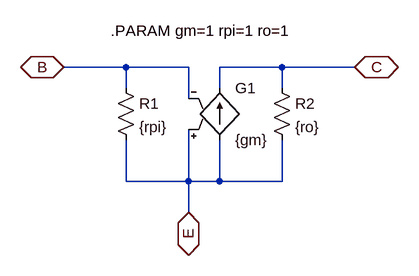
[diagram p0: schematic pnp_small_signal.asc]
pnp_small_signal.asc, the LTspice schematic file:
Version 4
SHEET 1 880 680
WIRE 176 80 80 80
WIRE 272 80 176 80
WIRE 416 80 320 80
WIRE 528 80 416 80
WIRE 176 112 176 80
WIRE 320 112 320 80
WIRE 416 112 416 80
WIRE 272 128 272 80
WIRE 176 256 176 192
WIRE 272 256 272 176
WIRE 272 256 176 256
WIRE 320 256 320 192
WIRE 320 256 272 256
WIRE 416 256 416 192
WIRE 416 256 320 256
WIRE 272 304 272 256
FLAG 80 80 B
IOPIN 80 80 BiDir
FLAG 272 304 E
IOPIN 272 304 BiDir
FLAG 528 80 C
IOPIN 528 80 BiDir
SYMBOL res 160 96 R0
SYMATTR InstName R1
SYMATTR Value {rpi}
SYMBOL res 400 96 R0
SYMATTR InstName R2
SYMATTR Value {ro}
SYMBOL g2 320 96 R0
SYMATTR InstName G1
SYMATTR Value {gm}
TEXT 152 24 Left 2 !.PARAM gm=1 rpi=1 ro=1

The netlist it stands for:
* pnp_small_signal.asc
R1 B E {rpi}
R2 C E {ro}
G1 E C E B {gm}
.PARAM gm=1 rpi=1 ro=1
.backanno
.end